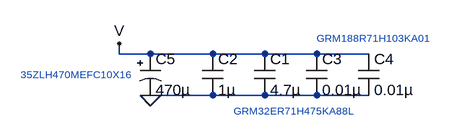
[diagram p0: schematic localFilter.asc]
localFilter.asc, the LTspice schematic file:
Version 4
SHEET 1 880 680
WIRE 192 80 192 64
WIRE 240 80 192 80
WIRE 336 80 240 80
WIRE 416 80 336 80
WIRE 496 80 416 80
WIRE 576 80 496 80
WIRE 336 144 240 144
WIRE 416 144 336 144
WIRE 496 144 416 144
WIRE 576 144 496 144
FLAG 192 64 V
FLAG 240 144 0
SYMBOL cap 400 80 R0
SYMATTR InstName C1
SYMATTR Value 4.7µ
SYMATTR SpiceLine V=50 Irms=0 Rser=5m Lser=1n
SYMBOL cap 480 80 R0
SYMATTR InstName C3
SYMATTR Value 0.01µ
SYMATTR SpiceLine V=50 Irms=272m Rser=0.02 Lser=0
SYMBOL cap 560 80 R0
SYMATTR InstName C4
SYMATTR Value 0.01µ
SYMATTR SpiceLine V=50 Irms=272m Rser=0.02 Lser=.5n
SYMBOL polcap 224 80 R0
WINDOW 3 24 56 Left 2
SYMATTR Value 470µ
SYMATTR InstName C5
SYMATTR Description Capacitor
SYMATTR Type cap
SYMATTR SpiceLine V=63 Irms=.968 Rser=.028 Lser=12n
SYMBOL cap 320 80 R0
SYMATTR InstName C2
SYMATTR Value 1µ
SYMATTR SpiceLine V=50 Irms=0 Rser=5m Lser=1n
TEXT 208 112 Right 1 ;35ZLH470MEFC10X16
TEXT 368 168 Left 1 ;GRM32ER71H475KA88L
TEXT 496 56 Left 1 ;GRM188R71H103KA01

The netlist it stands for:
* localFilter.asc
C1 V 0 4.7µ V=50 Irms=0 Rser=5m Lser=1n
C3 V 0 0.01µ V=50 Irms=272m Rser=0.02 Lser=0
C4 V 0 0.01µ V=50 Irms=272m Rser=0.02 Lser=.5n
C5 V 0 470µ V=63 Irms=.968 Rser=.028 Lser=12n
C2 V 0 1µ V=50 Irms=0 Rser=5m Lser=1n
* 35ZLH470MEFC10X16
* GRM32ER71H475KA88L
* GRM188R71H103KA01
.backanno
.end